# Altium project PowerBoard.PrjPcb (part 2 of 2)

## Sheet ESC_B.SchDoc
size A3; SheetNumber: 8; SheetTotal: 10
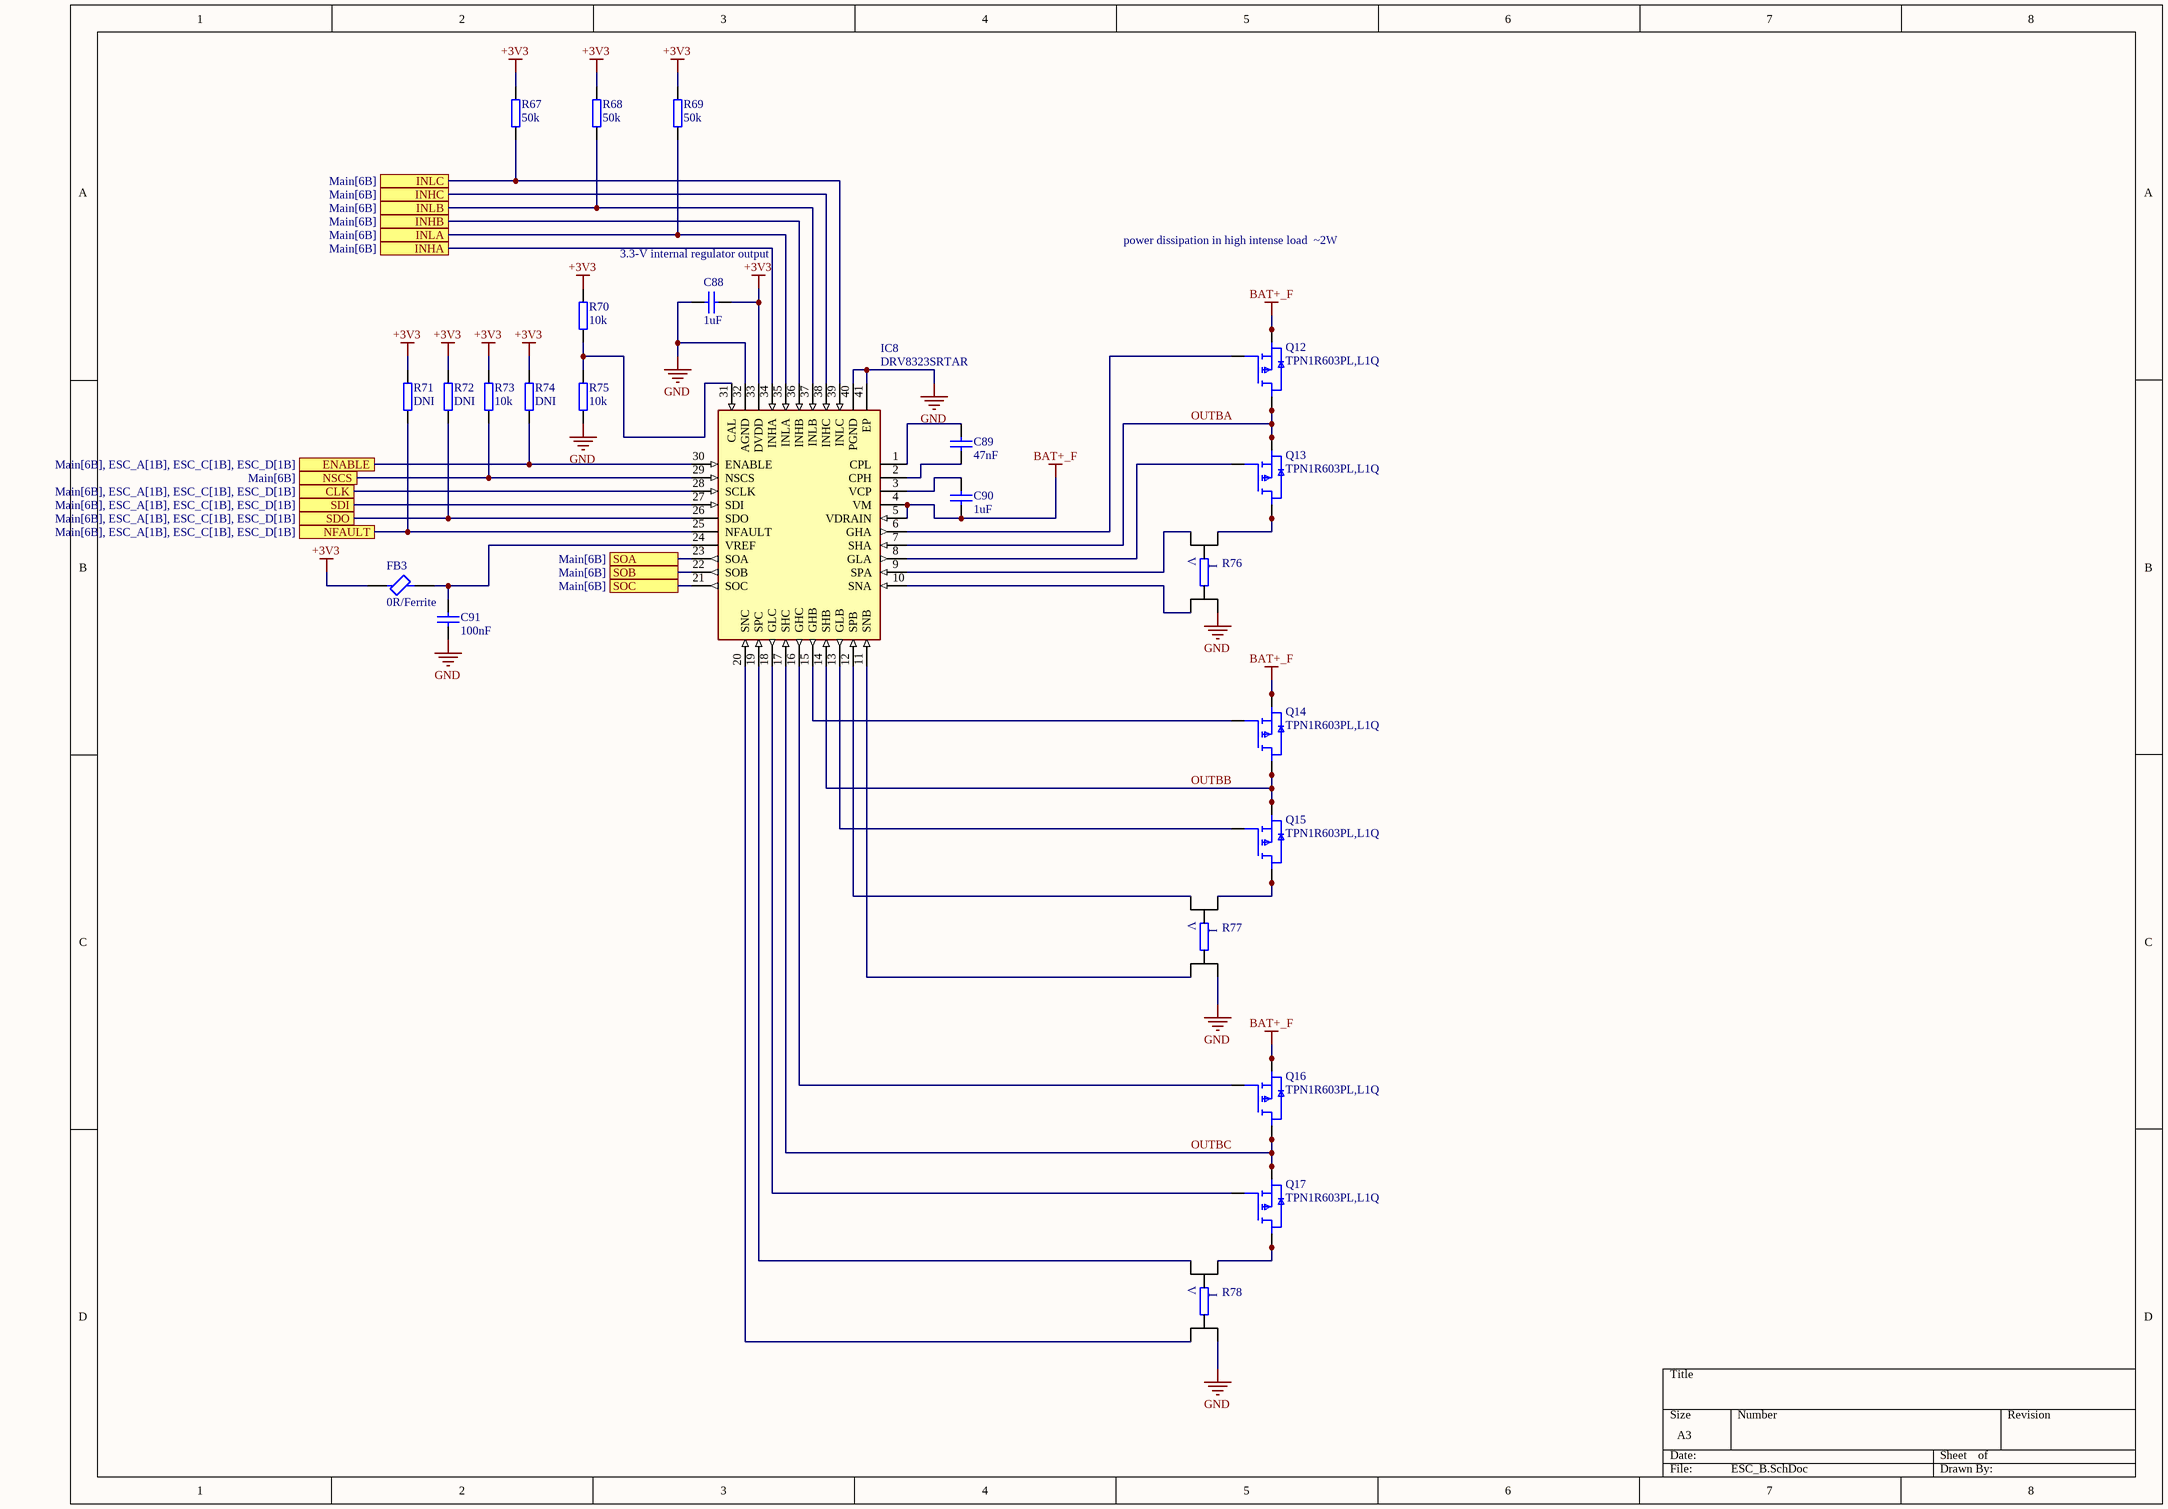
[diagram p8: ESC_B.SchDoc]

### Parts
C88  value 1uF  [CAP0402]  (hidden comment: Cap0402)
C89  value 47nF  [CAP0603]  (hidden comment: Cap0603)
C90  value 1uF  [CAP0603]  (hidden comment: Cap0603)
C91  value 100nF  [CAP0402]  (hidden comment: Cap0402)
FB3  0R/Ferrite  [NFZ15SG152SN10B]
IC8  DRV8323SRTAR  [QFN50P600X600X80-41N-D]
Q12  TPN1R603PL,L1Q  [TPN1R603PLL1Q]
Q13  TPN1R603PL,L1Q  [TPN1R603PLL1Q]
Q14  TPN1R603PL,L1Q  [TPN1R603PLL1Q]
Q15  TPN1R603PL,L1Q  [TPN1R603PLL1Q]
Q16  TPN1R603PL,L1Q  [TPN1R603PLL1Q]
Q17  TPN1R603PL,L1Q  [TPN1R603PLL1Q]
R67  value 50k  [RES0402]  (hidden comment: Res0402)
R68  value 50k  [RES0402]  (hidden comment: Res0402)
R69  value 50k  [RES0402]  (hidden comment: Res0402)
R70  value 10k  [RES0402]  (hidden comment: Res0402)
R71  value DNI  [RES0402]  (hidden comment: Res0402)
R72  value DNI  [RES0402]  (hidden comment: Res0402)
R73  value 10k  [RES0402]  (hidden comment: Res0402)
R74  value DNI  [RES0402]  (hidden comment: Res0402)
R75  value 10k  [RES0402]  (hidden comment: Res0402)
R76  WSK12161L000FEA  [WSK12161L000FEA]  (value not drawn)
R77  WSK12161L000FEA  [WSK12161L000FEA]  (value not drawn)
R78  WSK12161L000FEA  [WSK12161L000FEA]  (value not drawn)

### Ports
CLK (see Main[6B], ESC_A[1B], ESC_C[1B], ESC_D[1B]), ENABLE (see Main[6B], ESC_A[1B], ESC_C[1B], ESC_D[1B]), INHA (see Main[6B]), INHB (see Main[6B]), INHC (see Main[6B]), INLA (see Main[6B]), INLB (see Main[6B]), INLC (see Main[6B]), NFAULT (see Main[6B], ESC_A[1B], ESC_C[1B], ESC_D[1B]), NSCS (see Main[6B]), SDI (see Main[6B], ESC_A[1B], ESC_C[1B], ESC_D[1B]), SDO (see Main[6B], ESC_A[1B], ESC_C[1B], ESC_D[1B]), SOA (see Main[6B]), SOB (see Main[6B]), SOC (see Main[6B])

### Nets
+3V3: C88.2 FB3.1 IC8.33(DVDD) R67.2 R68.2 R69.2 R70.2 R71.2 R72.2 R73.2 R74.2
BAT+_F: C90.1 IC8.4(VM) IC8.5(VDRAIN) Q12.1(S_1) Q12.2(S_2) Q12.3(S_3) Q14.1(S_1) Q14.2(S_2) Q14.3(S_3) Q16.1(S_1) Q16.2(S_2) Q16.3(S_3)
GND: C88.1 C91.1 IC8.32(AGND) IC8.40(PGND) IC8.41(EP) R75.1 R76.4 R77.4 R78.4
ESC_CLK: IC8.28(SCLK) ; port CLK
ESC_ENABLE: IC8.30(ENABLE) R74.1 ; port ENABLE
ESC_INHA_B: IC8.34(INHA) ; port INHA
ESC_INHB_B: IC8.36(INHB) ; port INHB
ESC_INHC_B: IC8.38(INHC) ; port INHC
ESC_INLA_B: IC8.35(INLA) R69.1 ; port INLA
ESC_INLB_B: IC8.37(INLB) R68.1 ; port INLB
ESC_INLC_B: IC8.39(INLC) R67.1 ; port INLC
ESC_NFAULT: IC8.25(NFAULT) R71.1 ; port NFAULT
ESC_NSCS_B: IC8.29(NSCS) R73.1 ; port NSCS
ESC_SDI: IC8.27(SDI) ; port SDI
ESC_SDO: IC8.26(SDO) R72.1 ; port SDO
ESC_SOA_B: IC8.23(SOA) ; port SOA
ESC_SOB_B: IC8.22(SOB) ; port SOB
ESC_SOC_B: IC8.21(SOC) ; port SOC
OUTBA: IC8.7(SHA) Q12.5(D_1) Q12.6(D_2) Q12.7(D_3) Q12.8(D_4) Q12.9(D_4) Q13.1(S_1) Q13.2(S_2) Q13.3(S_3)
OUTBB: IC8.14(SHB) Q14.5(D_1) Q14.6(D_2) Q14.7(D_3) Q14.8(D_4) Q14.9(D_4) Q15.1(S_1) Q15.2(S_2) Q15.3(S_3)
OUTBC: IC8.17(SHC) Q16.5(D_1) Q16.6(D_2) Q16.7(D_3) Q16.8(D_4) Q16.9(D_4) Q17.1(S_1) Q17.2(S_2) Q17.3(S_3)
NetC89_1: C89.1 IC8.2(CPH)
NetC89_2: C89.2 IC8.1(CPL)
NetC90_2: C90.2 IC8.3(VCP)
NetC91_2: C91.2 FB3.2 IC8.24(VREF)
NetIC8_6: IC8.6(GHA) Q12.4(G)
NetIC8_8: IC8.8(GLA) Q13.4(G)
NetIC8_9: IC8.9(SPA) R76.2
NetIC8_10: IC8.10(SNA) R76.3
NetIC8_11: IC8.11(SNB) R77.3
NetIC8_12: IC8.12(SPB) R77.2
NetIC8_13: IC8.13(GLB) Q15.4(G)
NetIC8_15: IC8.15(GHB) Q14.4(G)
NetIC8_16: IC8.16(GHC) Q16.4(G)
NetIC8_18: IC8.18(GLC) Q17.4(G)
NetIC8_19: IC8.19(SPC) R78.2
NetIC8_20: IC8.20(SNC) R78.3
NetIC8_31: IC8.31(CAL) R70.1 R75.2
NetQ13_5: Q13.5(D_1) Q13.6(D_2) Q13.7(D_3) Q13.8(D_4) Q13.9(D_4) R76.1
NetQ15_5: Q15.5(D_1) Q15.6(D_2) Q15.7(D_3) Q15.8(D_4) Q15.9(D_4) R77.1
NetQ17_5: Q17.5(D_1) Q17.6(D_2) Q17.7(D_3) Q17.8(D_4) Q17.9(D_4) R78.1

### Notes on the sheet
- power dissipation in high intense load  ~2W
- 3.3-V internal regulator output
- (near IC8) Separate grounds?
- (in symbol WSK1216L5000FEA) V; I

### Library data of the parts
C88 = Cap0402: Manufacturer_Part_Number: GRM155R61H105KE05J; Voltage: 50V
C89 C90 = CapSMD0603: 50V; Published: 8-Jun-2000; LatestRevisionDate: 29-May-2009; LatestRevisionNote: IPC-7351 Footprint Added.; PackageReference: C1206; Publisher: Altium Limited; PackageDescription: Chip Capacitor
C91 = Cap0402: Manufacturer_Part_Number: GRM155R71H104ME14D; Voltage: 50V
FB3 = BLM15PE471SH1D: Ferrite Bead; Manufacturer_Name: Murata Electronics; Datasheet Link: https://www.murata.com/en-global/products/productdetail.aspx?cate=luNoiseSupprFilteChipFerriBead&partno=BLM15PE471SH1%23; Height: 0.55mm; Manufacturer_Part_Number: BLM15PE471SH1D; Mouser Part Number: 81-BLM15PE471SH1D; Mouser Price/Stock: https://www.mouser.co.uk/ProductDetail/Murata-Electronics/BLM15PE471SH1D?qs=DRkmTr78QATAY5qAVx1hGA%3D%3D
IC8 = DRV8323SRTAR: Integrated Circuit; Manufacturer_Name: Texas Instruments; Datasheet Link: http://www.ti.com/lit/ds/symlink/drv8323.pdf; Height: 0.8mm; Manufacturer_Part_Number: DRV8323SRTAR; Mouser Part Number: 595-DRV8323SRTAR; Mouser Price/Stock: https://www.mouser.co.uk/ProductDetail/Texas-Instruments/DRV8323SRTAR?qs=u4fy%2FsgLU9P2gpPTX6mffg%3D%3D; Arrow Part Number: DRV8323SRTAR; Arrow Price/Stock: https://www.arrow.com/en/products/drv8323srtar/texas-instruments?utm_currency=USD&region=nac
Q12-Q17 = TPN1R603PL,L1Q: MOSFET (N-Channel); Manufacturer_Name: Toshiba; Datasheet Link: https://toshiba.semicon-storage.com/ap-en/semiconductor/product/mosfets/12v-300v-mosfets/detail.TPN1R603PL.html; Height: 0.9mm; Manufacturer_Part_Number: TPN1R603PL,L1Q; Mouser Part Number: 757-TPN1R603PLL1Q; Mouser Price/Stock: https://www.mouser.co.uk/ProductDetail/Toshiba/TPN1R603PLL1Q?qs=bUPhaerQQeGYpGlYi%252BLguw%3D%3D; Arrow Part Number: TPN1R603PL,L1Q; Arrow Price/Stock: https://www.arrow.com/en/products/tpn1r603pll1q/toshiba?utm_currency=USD&region=nac
R67-R69 = Res0402: Manufacturer_Part_Number: TNPW040249K9DEED
R70 R73 R75 = Res0402: Manufacturer_Part_Number: ERA-2AED103X
R76-R78 = WSK1216L5000FEA: Resistor; Manufacturer_Name: Vishay; Datasheet Link: http://www.vishay.com/docs/30189/wsk1216.pdf; Height: 1.9mm; Manufacturer_Part_Number: WSK1216L5000FEA; Mouser Part Number: 71-WSK1216L5000FEA; Mouser Price/Stock: https://www.mouser.co.uk/ProductDetail/Vishay-Dale/WSK1216L5000FEA?qs=OlC7AqGiEDlM2wGD42LFoQ%3D%3D; Arrow Part Number: WSK1216L5000FEA; Arrow Price/Stock: https://www.arrow.com/en/products/wsk1216l5000fea/vishay?region=nac

## Sheet ESC_C.SchDoc
size A3; SheetNumber: 9; SheetTotal: 10
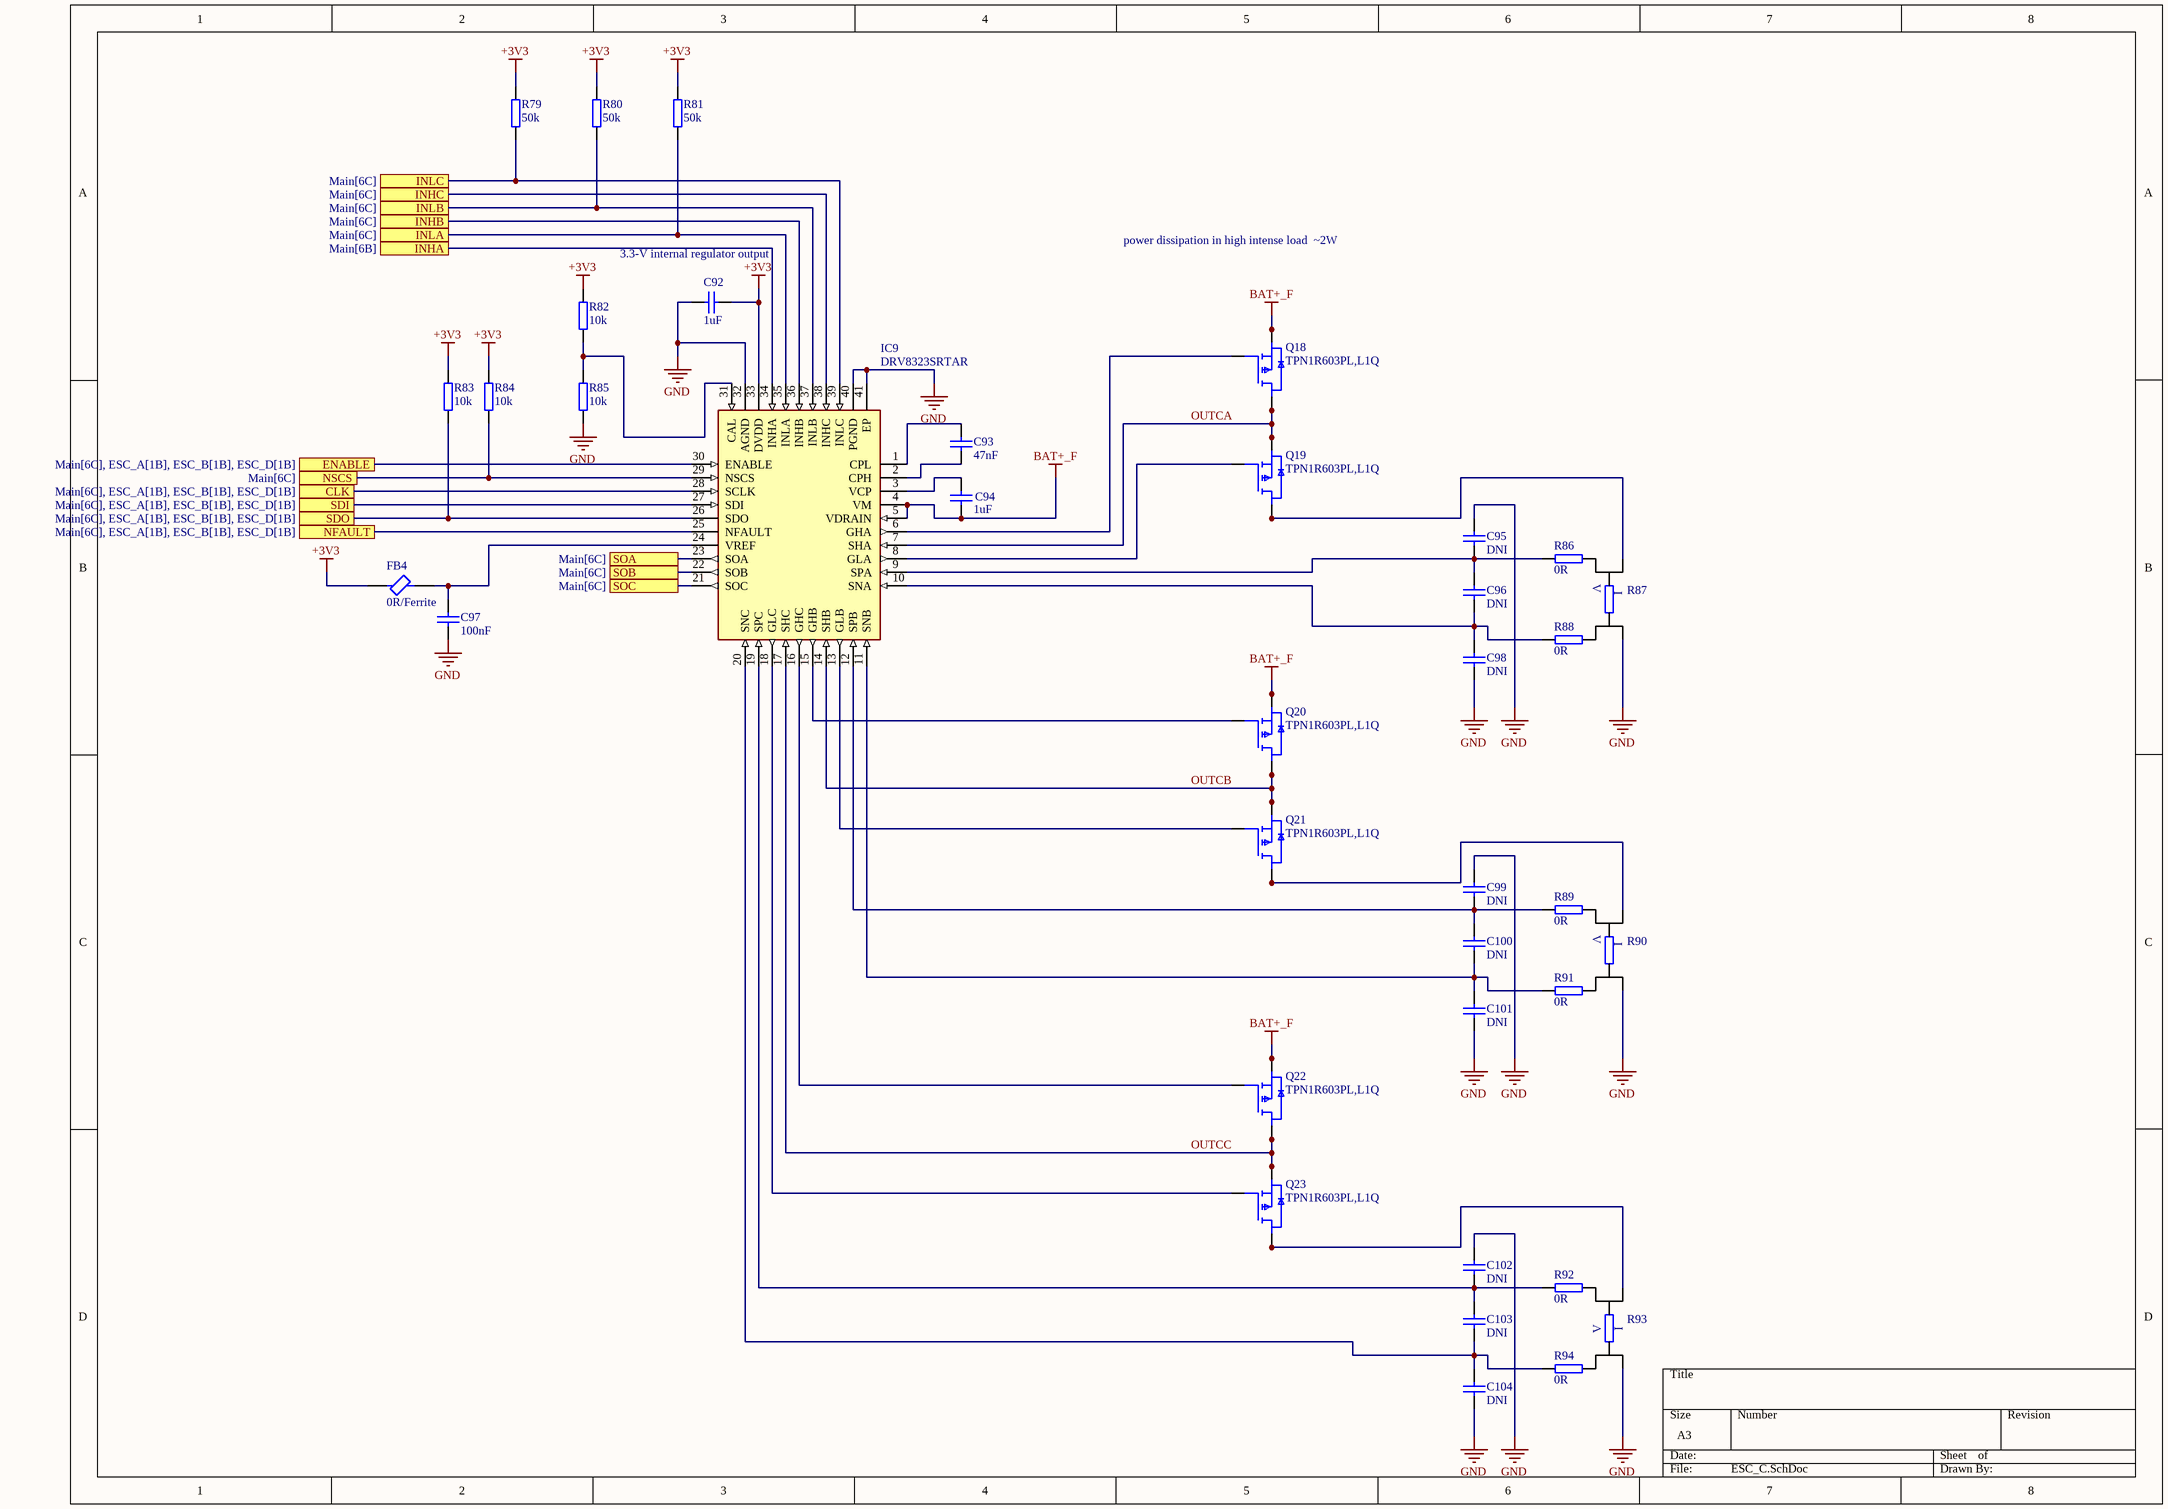
[diagram p9: ESC_C.SchDoc]

### Parts
C92  value 1uF  [CAP0402]  (hidden comment: Cap0402)
C93  value 47nF  [CAP0603]  (hidden comment: Cap0603)
C94  value 1uF  [CAP0603]  (hidden comment: Cap0603)
C95  value DNI  [CAP0402]  (hidden comment: Cap0402)
C96  value DNI  [CAP0402]  (hidden comment: Cap0402)
C97  value 100nF  [CAP0402]  (hidden comment: Cap0402)
C98  value DNI  [CAP0402]  (hidden comment: Cap0402)
C99  value DNI  [CAP0402]  (hidden comment: Cap0402)
C100  value DNI  [CAP0402]  (hidden comment: Cap0402)
C101  value DNI  [CAP0402]  (hidden comment: Cap0402)
C102  value DNI  [CAP0402]  (hidden comment: Cap0402)
C103  value DNI  [CAP0402]  (hidden comment: Cap0402)
C104  value DNI  [CAP0402]  (hidden comment: Cap0402)
FB4  0R/Ferrite  [NFZ15SG152SN10B]
IC9  DRV8323SRTAR  [QFN50P600X600X80-41N-D]
Q18  TPN1R603PL,L1Q  [TPN1R603PLL1Q]
Q19  TPN1R603PL,L1Q  [TPN1R603PLL1Q]
Q20  TPN1R603PL,L1Q  [TPN1R603PLL1Q]
Q21  TPN1R603PL,L1Q  [TPN1R603PLL1Q]
Q22  TPN1R603PL,L1Q  [TPN1R603PLL1Q]
Q23  TPN1R603PL,L1Q  [TPN1R603PLL1Q]
R79  value 50k  [RES0402]  (hidden comment: Res0402)
R80  value 50k  [RES0402]  (hidden comment: Res0402)
R81  value 50k  [RES0402]  (hidden comment: Res0402)
R82  value 10k  [RES0402]  (hidden comment: Res0402)
R83  value 10k  [RES0402]  (hidden comment: Res0402)
R84  value 10k  [RES0402]  (hidden comment: Res0402)
R85  value 10k  [RES0402]  (hidden comment: Res0402)
R86  value 0R  [RES0402]  (hidden comment: Res0402)
R87  WSK12161L000FEA  [WSK12161L000FEA]  (value not drawn)
R88  value 0R  [RES0402]  (hidden comment: Res0402)
R89  value 0R  [RES0402]  (hidden comment: Res0402)
R90  WSK12161L000FEA  [WSK12161L000FEA]  (value not drawn)
R91  value 0R  [RES0402]  (hidden comment: Res0402)
R92  value 0R  [RES0402]  (hidden comment: Res0402)
R93  WSK12161L000FEA  [WSK12161L000FEA]  (value not drawn)
R94  value 0R  [RES0402]  (hidden comment: Res0402)

### Ports
CLK (see Main[6C], ESC_A[1B], ESC_B[1B], ESC_D[1B]), ENABLE (see Main[6C], ESC_A[1B], ESC_B[1B], ESC_D[1B]), INHA (see Main[6B]), INHB (see Main[6C]), INHC (see Main[6C]), INLA (see Main[6C]), INLB (see Main[6C]), INLC (see Main[6C]), NFAULT (see Main[6C], ESC_A[1B], ESC_B[1B], ESC_D[1B]), NSCS (see Main[6C]), SDI (see Main[6C], ESC_A[1B], ESC_B[1B], ESC_D[1B]), SDO (see Main[6C], ESC_A[1B], ESC_B[1B], ESC_D[1B]), SOA (see Main[6C]), SOB (see Main[6C]), SOC (see Main[6C])

### Nets
+3V3: C92.2 FB4.1 IC9.33(DVDD) R79.2 R80.2 R81.2 R82.2 R83.2 R84.2
BAT+_F: C94.1 IC9.4(VM) IC9.5(VDRAIN) Q18.1(S_1) Q18.2(S_2) Q18.3(S_3) Q20.1(S_1) Q20.2(S_2) Q20.3(S_3) Q22.1(S_1) Q22.2(S_2) Q22.3(S_3)
GND: C92.1 C95.1 C97.1 C98.2 C99.1 C101.2 C102.1 C104.2 IC9.32(AGND) IC9.40(PGND) IC9.41(EP) R85.1 R87.4 R90.4 R93.1
ESC_CLK: IC9.28(SCLK) ; port CLK
ESC_ENABLE: IC9.30(ENABLE) ; port ENABLE
ESC_INHA_C: IC9.34(INHA) ; port INHA
ESC_INHB_C: IC9.36(INHB) ; port INHB
ESC_INHC_C: IC9.38(INHC) ; port INHC
ESC_INLA_C: IC9.35(INLA) R81.1 ; port INLA
ESC_INLB_C: IC9.37(INLB) R80.1 ; port INLB
ESC_INLC_C: IC9.39(INLC) R79.1 ; port INLC
ESC_NFAULT: IC9.25(NFAULT) ; port NFAULT
ESC_NSCS_C: IC9.29(NSCS) R84.1 ; port NSCS
ESC_SDI: IC9.27(SDI) ; port SDI
ESC_SDO: IC9.26(SDO) R83.1 ; port SDO
ESC_SOA_C: IC9.23(SOA) ; port SOA
ESC_SOB_C: IC9.22(SOB) ; port SOB
ESC_SOC_C: IC9.21(SOC) ; port SOC
OUTCA: IC9.7(SHA) Q18.5(D_1) Q18.6(D_2) Q18.7(D_3) Q18.8(D_4) Q18.9(D_4) Q19.1(S_1) Q19.2(S_2) Q19.3(S_3)
OUTCB: IC9.14(SHB) Q20.5(D_1) Q20.6(D_2) Q20.7(D_3) Q20.8(D_4) Q20.9(D_4) Q21.1(S_1) Q21.2(S_2) Q21.3(S_3)
OUTCC: IC9.17(SHC) Q22.5(D_1) Q22.6(D_2) Q22.7(D_3) Q22.8(D_4) Q22.9(D_4) Q23.1(S_1) Q23.2(S_2) Q23.3(S_3)
NetC93_1: C93.1 IC9.2(CPH)
NetC93_2: C93.2 IC9.1(CPL)
NetC94_2: C94.2 IC9.3(VCP)
NetC95_2: C95.2 C96.1 IC9.9(SPA) R86.1
NetC96_2: C96.2 C98.1 IC9.10(SNA) R88.1
NetC97_2: C97.2 FB4.2 IC9.24(VREF)
NetC99_2: C99.2 C100.1 IC9.12(SPB) R89.1
NetC100_2: C100.2 C101.1 IC9.11(SNB) R91.1
NetC102_2: C102.2 C103.1 IC9.19(SPC) R92.1
NetC103_2: C103.2 C104.1 IC9.20(SNC) R94.1
NetIC9_6: IC9.6(GHA) Q18.4(G)
NetIC9_8: IC9.8(GLA) Q19.4(G)
NetIC9_13: IC9.13(GLB) Q21.4(G)
NetIC9_15: IC9.15(GHB) Q20.4(G)
NetIC9_16: IC9.16(GHC) Q22.4(G)
NetIC9_18: IC9.18(GLC) Q23.4(G)
NetIC9_31: IC9.31(CAL) R82.1 R85.2
NetQ19_5: Q19.5(D_1) Q19.6(D_2) Q19.7(D_3) Q19.8(D_4) Q19.9(D_4) R87.1
NetQ21_5: Q21.5(D_1) Q21.6(D_2) Q21.7(D_3) Q21.8(D_4) Q21.9(D_4) R90.1
NetQ23_5: Q23.5(D_1) Q23.6(D_2) Q23.7(D_3) Q23.8(D_4) Q23.9(D_4) R93.4
NetR86_2: R86.2 R87.2
NetR87_3: R87.3 R88.2
NetR89_2: R89.2 R90.2
NetR90_3: R90.3 R91.2
NetR92_2: R92.2 R93.3
NetR93_2: R93.2 R94.2

### Notes on the sheet
- power dissipation in high intense load  ~2W
- 3.3-V internal regulator output
- (near IC9) Separate grounds?
- (in symbol WSK1216L5000FEA) V; I

### Library data of the parts
C92 = Cap0402: as C88 on sheet ESC_B
C93 C94 = CapSMD0603: 50V; Published: 8-Jun-2000; LatestRevisionDate: 29-May-2009; LatestRevisionNote: IPC-7351 Footprint Added.; PackageReference: C1206; Publisher: Altium Limited; PackageDescription: Chip Capacitor
C97 = Cap0402: as C91 on sheet ESC_B
FB4 = BLM15PE471SH1D: as FB3 on sheet ESC_B; Datasheet Link: https://www.murata.com/en-global/products/productdetail.aspx?cate=luNoiseSupprFilteChipFerriBead&partno=BLM15PE471SH1%23; Height: 0.55mm; Manufacturer_Part_Number: BLM15PE471SH1D; Mouser Part Number: 81-BLM15PE471SH1D; Mouser Price/Stock: https://www.mouser.co.uk/ProductDetail/Murata-Electronics/BLM15PE471SH1D?qs=DRkmTr78QATAY5qAVx1hGA%3D%3D
IC9 = DRV8323SRTAR: as IC8 on sheet ESC_B; Datasheet Link: http://www.ti.com/lit/ds/symlink/drv8323.pdf; Height: 0.8mm; Manufacturer_Part_Number: DRV8323SRTAR; Mouser Part Number: 595-DRV8323SRTAR; Mouser Price/Stock: https://www.mouser.co.uk/ProductDetail/Texas-Instruments/DRV8323SRTAR?qs=u4fy%2FsgLU9P2gpPTX6mffg%3D%3D; Arrow Part Number: DRV8323SRTAR; Arrow Price/Stock: https://www.arrow.com/en/products/drv8323srtar/texas-instruments?utm_currency=USD&region=nac
Q18-Q23 = TPN1R603PL,L1Q: as Q12 on sheet ESC_B; Datasheet Link: https://toshiba.semicon-storage.com/ap-en/semiconductor/product/mosfets/12v-300v-mosfets/detail.TPN1R603PL.html; Height: 0.9mm; Manufacturer_Part_Number: TPN1R603PL,L1Q; Mouser Part Number: 757-TPN1R603PLL1Q; Mouser Price/Stock: https://www.mouser.co.uk/ProductDetail/Toshiba/TPN1R603PLL1Q?qs=bUPhaerQQeGYpGlYi%252BLguw%3D%3D; Arrow Part Number: TPN1R603PL,L1Q; Arrow Price/Stock: https://www.arrow.com/en/products/tpn1r603pll1q/toshiba?utm_currency=USD&region=nac
R79-R81 = Res0402: as R67 on sheet ESC_B
R82-R85 = Res0402: Manufacturer_Part_Number: ERA-2AED103X
R86 R88 R89 R91 R92 R94 = Res0402: Manufacturer_Part_Number: RCA04020000ZSED
R87 R90 R93 = WSK1216L5000FEA: Resistor; Manufacturer_Name: Vishay; Datasheet Link: http://www.vishay.com/docs/30189/wsk1216.pdf; Height: 1.9mm; Manufacturer_Part_Number: WSK1216L5000FEA; Mouser Part Number: 71-WSK1216L5000FEA; Mouser Price/Stock: https://www.mouser.co.uk/ProductDetail/Vishay-Dale/WSK1216L5000FEA?qs=OlC7AqGiEDlM2wGD42LFoQ%3D%3D; Arrow Part Number: WSK1216L5000FEA; Arrow Price/Stock: https://www.arrow.com/en/products/wsk1216l5000fea/vishay?region=nac
C95 C96 C98-C104 = Cap0402: Voltage: DNI

## Sheet ESC_D.SchDoc
size A3; SheetNumber: 10; SheetTotal: 10
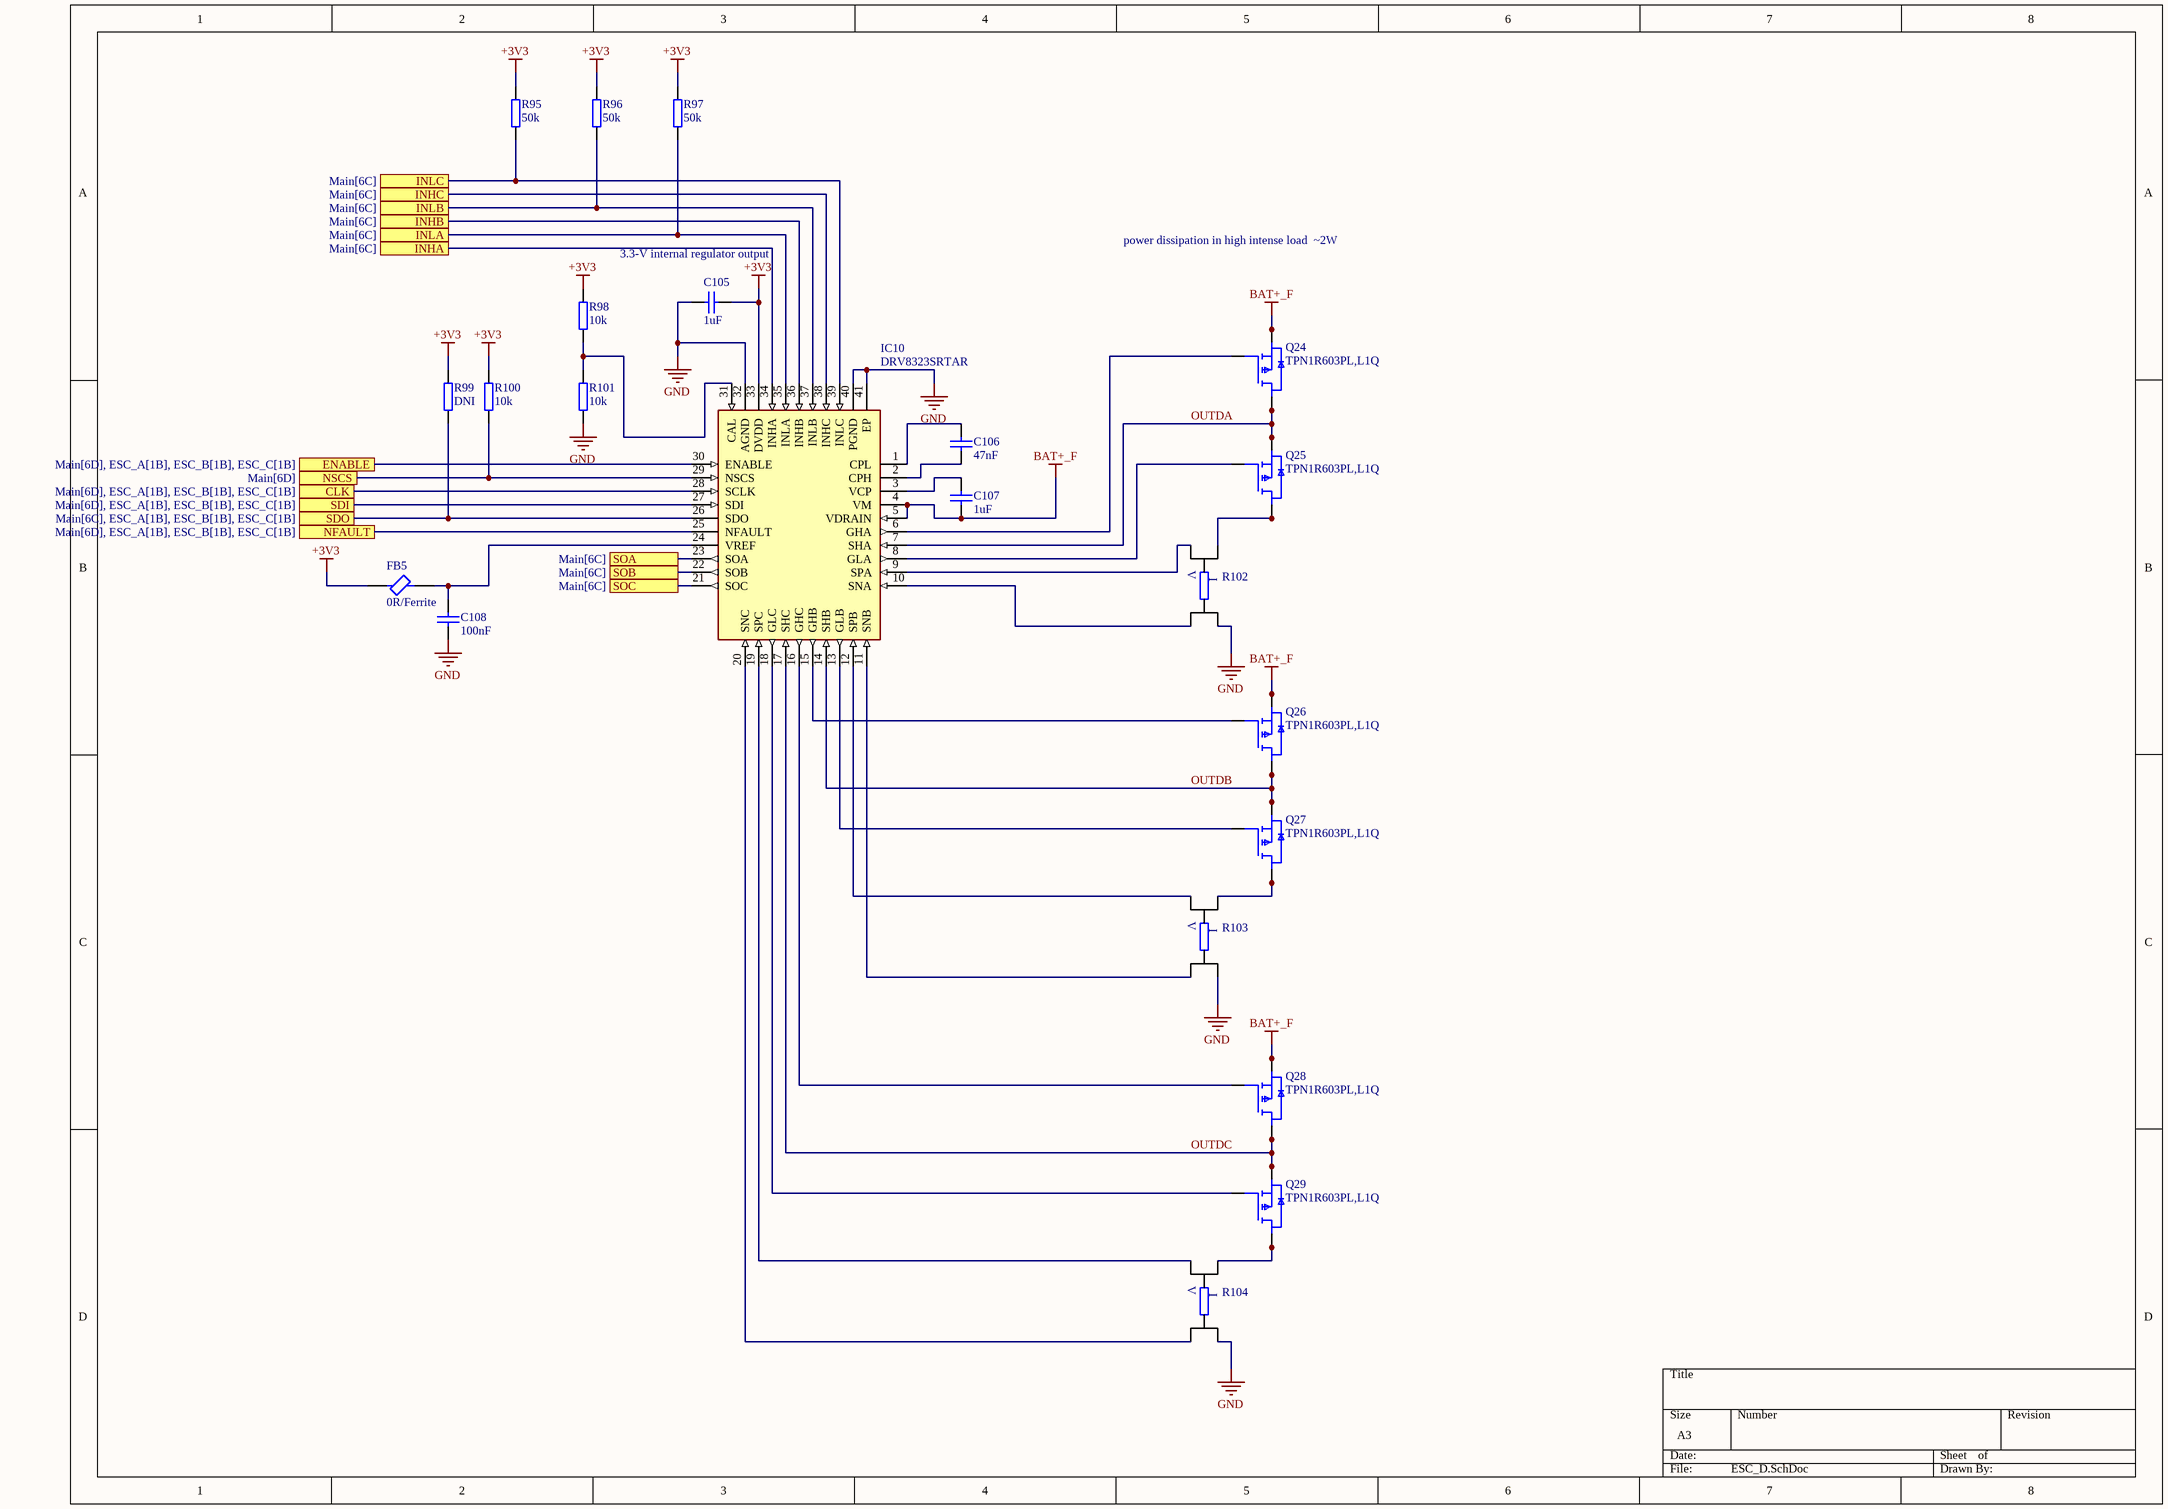
[diagram p10: ESC_D.SchDoc]

### Parts
C105  value 1uF  [CAP0402]  (hidden comment: Cap0402)
C106  value 47nF  [CAP0603]  (hidden comment: Cap0603)
C107  value 1uF  [CAP0603]  (hidden comment: Cap0603)
C108  value 100nF  [CAP0402]  (hidden comment: Cap0402)
FB5  0R/Ferrite  [NFZ15SG152SN10B]
IC10  DRV8323SRTAR  [QFN50P600X600X80-41N-D]
Q24  TPN1R603PL,L1Q  [TPN1R603PLL1Q]
Q25  TPN1R603PL,L1Q  [TPN1R603PLL1Q]
Q26  TPN1R603PL,L1Q  [TPN1R603PLL1Q]
Q27  TPN1R603PL,L1Q  [TPN1R603PLL1Q]
Q28  TPN1R603PL,L1Q  [TPN1R603PLL1Q]
Q29  TPN1R603PL,L1Q  [TPN1R603PLL1Q]
R95  value 50k  [RES0402]  (hidden comment: Res0402)
R96  value 50k  [RES0402]  (hidden comment: Res0402)
R97  value 50k  [RES0402]  (hidden comment: Res0402)
R98  value 10k  [RES0402]  (hidden comment: Res0402)
R99  value DNI  [RES0402]  (hidden comment: Res0402)
R100  value 10k  [RES0402]  (hidden comment: Res0402)
R101  value 10k  [RES0402]  (hidden comment: Res0402)
R102  WSK12161L000FEA  [WSK12161L000FEA]  (value not drawn)
R103  WSK12161L000FEA  [WSK12161L000FEA]  (value not drawn)
R104  WSK12161L000FEA  [WSK12161L000FEA]  (value not drawn)

### Ports
CLK (see Main[6D], ESC_A[1B], ESC_B[1B], ESC_C[1B]), ENABLE (see Main[6D], ESC_A[1B], ESC_B[1B], ESC_C[1B]), INHA (see Main[6C]), INHB (see Main[6C]), INHC (see Main[6C]), INLA (see Main[6C]), INLB (see Main[6C]), INLC (see Main[6C]), NFAULT (see Main[6D], ESC_A[1B], ESC_B[1B], ESC_C[1B]), NSCS (see Main[6D]), SDI (see Main[6D], ESC_A[1B], ESC_B[1B], ESC_C[1B]), SDO (see Main[6C], ESC_A[1B], ESC_B[1B], ESC_C[1B]), SOA (see Main[6C]), SOB (see Main[6C]), SOC (see Main[6C])

### Nets
+3V3: C105.2 FB5.1 IC10.33(DVDD) R95.2 R96.2 R97.2 R98.2 R99.2 R100.2
BAT+_F: C107.1 IC10.4(VM) IC10.5(VDRAIN) Q24.1(S_1) Q24.2(S_2) Q24.3(S_3) Q26.1(S_1) Q26.2(S_2) Q26.3(S_3) Q28.1(S_1) Q28.2(S_2) Q28.3(S_3)
GND: C105.1 C108.1 IC10.32(AGND) IC10.40(PGND) IC10.41(EP) R101.1 R102.4 R103.4 R104.4
ESC_CLK: IC10.28(SCLK) ; port CLK
ESC_ENABLE: IC10.30(ENABLE) ; port ENABLE
ESC_INHA_D: IC10.34(INHA) ; port INHA
ESC_INHB_D: IC10.36(INHB) ; port INHB
ESC_INHC_D: IC10.38(INHC) ; port INHC
ESC_INLA_D: IC10.35(INLA) R97.1 ; port INLA
ESC_INLB_D: IC10.37(INLB) R96.1 ; port INLB
ESC_INLC_D: IC10.39(INLC) R95.1 ; port INLC
ESC_NFAULT: IC10.25(NFAULT) ; port NFAULT
ESC_NSCS_D: IC10.29(NSCS) R100.1 ; port NSCS
ESC_SDI: IC10.27(SDI) ; port SDI
ESC_SDO: IC10.26(SDO) R99.1 ; port SDO
ESC_SOA_D: IC10.23(SOA) ; port SOA
ESC_SOB_D: IC10.22(SOB) ; port SOB
ESC_SOC_D: IC10.21(SOC) ; port SOC
OUTDA: IC10.7(SHA) Q24.5(D_1) Q24.6(D_2) Q24.7(D_3) Q24.8(D_4) Q24.9(D_4) Q25.1(S_1) Q25.2(S_2) Q25.3(S_3)
OUTDB: IC10.14(SHB) Q26.5(D_1) Q26.6(D_2) Q26.7(D_3) Q26.8(D_4) Q26.9(D_4) Q27.1(S_1) Q27.2(S_2) Q27.3(S_3)
OUTDC: IC10.17(SHC) Q28.5(D_1) Q28.6(D_2) Q28.7(D_3) Q28.8(D_4) Q28.9(D_4) Q29.1(S_1) Q29.2(S_2) Q29.3(S_3)
NetC106_1: C106.1 IC10.2(CPH)
NetC106_2: C106.2 IC10.1(CPL)
NetC107_2: C107.2 IC10.3(VCP)
NetC108_2: C108.2 FB5.2 IC10.24(VREF)
NetIC10_6: IC10.6(GHA) Q24.4(G)
NetIC10_8: IC10.8(GLA) Q25.4(G)
NetIC10_9: IC10.9(SPA) R102.2
NetIC10_10: IC10.10(SNA) R102.3
NetIC10_11: IC10.11(SNB) R103.3
NetIC10_12: IC10.12(SPB) R103.2
NetIC10_13: IC10.13(GLB) Q27.4(G)
NetIC10_15: IC10.15(GHB) Q26.4(G)
NetIC10_16: IC10.16(GHC) Q28.4(G)
NetIC10_18: IC10.18(GLC) Q29.4(G)
NetIC10_19: IC10.19(SPC) R104.2
NetIC10_20: IC10.20(SNC) R104.3
NetIC10_31: IC10.31(CAL) R98.1 R101.2
NetQ25_5: Q25.5(D_1) Q25.6(D_2) Q25.7(D_3) Q25.8(D_4) Q25.9(D_4) R102.1
NetQ27_5: Q27.5(D_1) Q27.6(D_2) Q27.7(D_3) Q27.8(D_4) Q27.9(D_4) R103.1
NetQ29_5: Q29.5(D_1) Q29.6(D_2) Q29.7(D_3) Q29.8(D_4) Q29.9(D_4) R104.1

### Notes on the sheet
- power dissipation in high intense load  ~2W
- 3.3-V internal regulator output
- (near IC10) Separate grounds?
- (in symbol WSK1216L5000FEA) V; I

### Library data of the parts
C105 = Cap0402: as C88 on sheet ESC_B
C106 C107 = CapSMD0603: 50V; Published: 8-Jun-2000; LatestRevisionDate: 29-May-2009; LatestRevisionNote: IPC-7351 Footprint Added.; PackageReference: C1206; Publisher: Altium Limited; PackageDescription: Chip Capacitor
C108 = Cap0402: as C91 on sheet ESC_B
FB5 = BLM15PE471SH1D: as FB3 on sheet ESC_B; Datasheet Link: https://www.murata.com/en-global/products/productdetail.aspx?cate=luNoiseSupprFilteChipFerriBead&partno=BLM15PE471SH1%23; Height: 0.55mm; Manufacturer_Part_Number: BLM15PE471SH1D; Mouser Part Number: 81-BLM15PE471SH1D; Mouser Price/Stock: https://www.mouser.co.uk/ProductDetail/Murata-Electronics/BLM15PE471SH1D?qs=DRkmTr78QATAY5qAVx1hGA%3D%3D
IC10 = DRV8323SRTAR: as IC8 on sheet ESC_B; Datasheet Link: http://www.ti.com/lit/ds/symlink/drv8323.pdf; Height: 0.8mm; Manufacturer_Part_Number: DRV8323SRTAR; Mouser Part Number: 595-DRV8323SRTAR; Mouser Price/Stock: https://www.mouser.co.uk/ProductDetail/Texas-Instruments/DRV8323SRTAR?qs=u4fy%2FsgLU9P2gpPTX6mffg%3D%3D; Arrow Part Number: DRV8323SRTAR; Arrow Price/Stock: https://www.arrow.com/en/products/drv8323srtar/texas-instruments?utm_currency=USD&region=nac
Q24-Q29 = TPN1R603PL,L1Q: as Q12 on sheet ESC_B; Datasheet Link: https://toshiba.semicon-storage.com/ap-en/semiconductor/product/mosfets/12v-300v-mosfets/detail.TPN1R603PL.html; Height: 0.9mm; Manufacturer_Part_Number: TPN1R603PL,L1Q; Mouser Part Number: 757-TPN1R603PLL1Q; Mouser Price/Stock: https://www.mouser.co.uk/ProductDetail/Toshiba/TPN1R603PLL1Q?qs=bUPhaerQQeGYpGlYi%252BLguw%3D%3D; Arrow Part Number: TPN1R603PL,L1Q; Arrow Price/Stock: https://www.arrow.com/en/products/tpn1r603pll1q/toshiba?utm_currency=USD&region=nac
R95-R97 = Res0402: as R67 on sheet ESC_B
R98 R100 R101 = Res0402: Manufacturer_Part_Number: ERA-2AED103X
R102-R104 = WSK1216L5000FEA: Resistor; Manufacturer_Name: Vishay; Datasheet Link: http://www.vishay.com/docs/30189/wsk1216.pdf; Height: 1.9mm; Manufacturer_Part_Number: WSK1216L5000FEA; Mouser Part Number: 71-WSK1216L5000FEA; Mouser Price/Stock: https://www.mouser.co.uk/ProductDetail/Vishay-Dale/WSK1216L5000FEA?qs=OlC7AqGiEDlM2wGD42LFoQ%3D%3D; Arrow Part Number: WSK1216L5000FEA; Arrow Price/Stock: https://www.arrow.com/en/products/wsk1216l5000fea/vishay?region=nac

## Nets that join several sheets
+3V3: BMS (7 pins), USB (9 pins), ADC+Temp (15 pins), ToF_Bottom (9 pins), FC_Conn (D8.1 R14.2), ESC_A (9 pins), ESC_B (11 pins), ESC_C (9 pins), ESC_D (9 pins)
BAT+_F: Main (C1.1 C2.1), BMS (26 pins), ADC+Temp (R9.2), ESC_A (12 pins), ESC_B (12 pins), ESC_C (12 pins), ESC_D (12 pins)
GND: Main (C1.2 C2.2), BMS (69 pins), USB (26 pins), ADC+Temp (27 pins), ToF_Bottom (8 pins), FC_Conn (11 pins), ESC_A (9 pins), ESC_B (9 pins), ESC_C (15 pins), ESC_D (9 pins)
BMS_CHRG_OK: BMS (IC3.4 R27.1), FC_Conn (D2.9 J1.10)
BMS_OTG/VAP: BMS (IC3.5), FC_Conn (D2.2 J1.11)
BMS_PROCHOT: BMS (IC3.11 R35.1), FC_Conn (D1.1 J1.1)
CB_ALERT: BMS (IC4.20 R48.2), FC_Conn (D2.1 J1.9)
D_N: USB (R56.2), FC_Conn (D6.1 J1.41)
D_P: USB (R55.2), FC_Conn (D7.1 J1.42)
ESC_CLK: FC_Conn (D5.6 J1.39), ESC_A (IC7.28), ESC_B (IC8.28), ESC_C (IC9.28), ESC_D (IC10.28)
ESC_ENABLE: FC_Conn (D5.5 J1.40), ESC_A (IC7.30), ESC_B (IC8.30 R74.1), ESC_C (IC9.30), ESC_D (IC10.30)
ESC_INHA_A: FC_Conn (D2.6 J1.15), ESC_A (IC7.34)
ESC_INHA_B: FC_Conn (D1.6 J1.7), ESC_B (IC8.34)
ESC_INHA_C: FC_Conn (D4.2 J1.27), ESC_C (IC9.34)
ESC_INHA_D: FC_Conn (D5.9 J1.34), ESC_D (IC10.34)
ESC_INHB_A: FC_Conn (D3.1 J1.17), ESC_A (IC7.36)
ESC_INHB_B: FC_Conn (D1.7 J1.5), ESC_B (IC8.36)
ESC_INHB_C: FC_Conn (D4.1 J1.25), ESC_C (IC9.36)
ESC_INHB_D: FC_Conn (D4.5 J1.32), ESC_D (IC10.36)
ESC_INHC_A: FC_Conn (D3.2 J1.19), ESC_A (IC7.38)
ESC_INHC_B: FC_Conn (D1.2 J1.3), ESC_B (IC8.38)
ESC_INHC_C: FC_Conn (D3.6 J1.23), ESC_C (IC9.38)
ESC_INHC_D: FC_Conn (D4.4 J1.30), ESC_D (IC10.38)
ESC_INLA_A: FC_Conn (D2.5 J1.16), ESC_A (IC7.35 R59.1)
ESC_INLA_B: FC_Conn (D1.4 J1.6), ESC_B (IC8.35 R69.1)
ESC_INLA_C: FC_Conn (D4.9 J1.26), ESC_C (IC9.35 R81.1)
ESC_INLA_D: FC_Conn (D5.1 J1.33), ESC_D (IC10.35 R97.1)
ESC_INLB_A: FC_Conn (D3.9 J1.18), ESC_A (IC7.37 R58.1)
ESC_INLB_B: FC_Conn (D1.8 J1.4), ESC_B (IC8.37 R68.1)
ESC_INLB_C: FC_Conn (D3.5 J1.24), ESC_C (IC9.37 R80.1)
ESC_INLB_D: FC_Conn (D4.6 J1.31), ESC_D (IC10.37 R96.1)
ESC_INLC_A: FC_Conn (D3.8 J1.20), ESC_A (IC7.39 R57.1)
ESC_INLC_B: FC_Conn (D1.9 J1.2), ESC_B (IC8.39 R67.1)
ESC_INLC_C: FC_Conn (D3.4 J1.22), ESC_C (IC9.39 R79.1)
ESC_INLC_D: FC_Conn (D4.7 J1.29), ESC_D (IC10.39 R95.1)
ESC_NFAULT: FC_Conn (D5.8 J1.36), ESC_A (IC7.25), ESC_B (IC8.25 R71.1), ESC_C (IC9.25), ESC_D (IC10.25)
ESC_NSCS_A: FC_Conn (D3.7 J1.21), ESC_A (IC7.29 R62.1)
ESC_NSCS_B: FC_Conn (D1.5 J1.8), ESC_B (IC8.29 R73.1)
ESC_NSCS_C: FC_Conn (D4.8 J1.28), ESC_C (IC9.29 R84.1)
ESC_NSCS_D: FC_Conn (D5.2 J1.35), ESC_D (IC10.29 R100.1)
ESC_SDI: FC_Conn (D5.4 J1.38), ESC_A (IC7.27), ESC_B (IC8.27), ESC_C (IC9.27), ESC_D (IC10.27)
ESC_SDO: FC_Conn (D5.7 J1.37), ESC_A (IC7.26 R61.1), ESC_B (IC8.26 R72.1), ESC_C (IC9.26 R83.1), ESC_D (IC10.26 R99.1)
ESC_SOA_A: ADC+Temp (IC1.10), ESC_A (IC7.23)
ESC_SOA_B: ADC+Temp (IC1.17), ESC_B (IC8.23)
ESC_SOA_C: ADC+Temp (IC1.14), ESC_C (IC9.23)
ESC_SOA_D: ADC+Temp (IC1.13), ESC_D (IC10.23)
ESC_SOB_A: ADC+Temp (IC1.9), ESC_A (IC7.22)
ESC_SOB_B: ADC+Temp (IC1.18), ESC_B (IC8.22)
ESC_SOB_C: ADC+Temp (IC1.15), ESC_C (IC9.22)
ESC_SOB_D: ADC+Temp (IC1.11), ESC_D (IC10.22)
ESC_SOC_A: ADC+Temp (IC1.8), ESC_A (IC7.21)
ESC_SOC_B: ADC+Temp (IC1.19), ESC_B (IC8.21)
ESC_SOC_C: ADC+Temp (IC1.16), ESC_C (IC9.21)
ESC_SOC_D: ADC+Temp (IC1.12), ESC_D (IC10.21)
SCL: BMS (IC3.13 IC4.5 R37.1 R43.1), USB (IC6.7 R53.1), ADC+Temp (IC1.2), ToF_Bottom (IC2.5), FC_Conn (D2.8 J1.12)
SDA: BMS (IC3.12 IC4.4 R36.1 R44.1), USB (IC6.6 R52.1), ADC+Temp (IC1.3), ToF_Bottom (IC2.6), FC_Conn (D2.7 J1.13)
TOF_INT: ToF_Bottom (IC2.4), FC_Conn (D2.4 J1.14)
VBUS: BMS (6 pins), USB (9 pins)
VSYS: BMS (17 pins), FC_Conn (D9.1 J1.46 J1.47)